# Altium schematic sheet GSM_Link_12_Power.SchDoc
size A
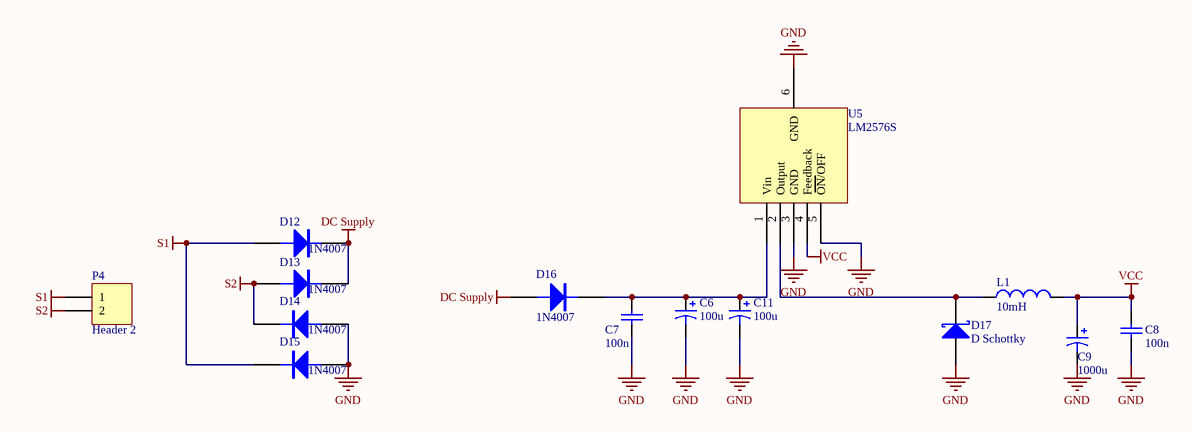
[diagram p0: GSM_Link_12_Power.SchDoc]

## Parts
C6  100u  [RB.2/.4_p]
C7  100n  [0805_smd]
C8  100n  [0805_smd]
C9  1000u  [RB.2/.4_p]
C11  100u  [RB.1/.2_P]
D12  1N4007  [7227_SMD]
D13  1N4007  [7227_SMD]
D14  1N4007  [7227_SMD]
D15  1N4007  [7227_SMD]
D16  1N4007  [7227_SMD]
D17  D Schottky  [7227_SMD]
L1  10mH  [RB.2/.4]
P4  Header 2  [PCON_2]
U5  LM2576S  [D2PAK_SMD]

## Nets
DC Supply: D12.K D13.K D16.A
GND: C6.2 C7.1 C8.1 C9.2 C11.2 D14.A D15.A D17.A U5.3(GND) U5.5(ON/OFF) U5.6(GND)
S1: D12.A D15.K P4.1
S2: D13.A D14.K P4.2
VCC: C8.2 C9.1 L1.2 U5.4(Feedback)
NetC6_1: C6.1 C7.2 C11.1 D16.K U5.1(Vin)
NetD17_K: D17.K L1.1 U5.2(Output)

## Library data of the parts
C6 C9 C11 = Cap Pol1: Polarized Capacitor (Radial); Value: 100nF; Published: 8-Jun-2000; LatestRevisionDate: 17-Jul-2002; LatestRevisionNote: Re-released for DXP Platform.; PackageReference: RB7.6-15; Publisher: Altium Limited
C7 C8 = Cap: Capacitor; Value: 100u; Published: 8-Jun-2000; LatestRevisionDate: 17-Jul-2002; LatestRevisionNote: Re-released for DXP Platform.; PackageReference: RAD-0.3; Publisher: Altium Limited
D12-D16 = DIODE
D17 = D Schottky: Schottky Diode; Published: 8-Jun-2000; LatestRevisionDate: 17-Jul-2002; LatestRevisionNote: Re-released for DXP Platform.; PackageReference: SMB; Publisher: Altium Limited; Code_JEDEC: DO-214-AA
L1 = Inductor: Code_IEC: 1005; Published: 8-Jun-2000; LatestRevisionDate: 17-Jul-2002; LatestRevisionNote: Re-released for DXP Platform.; PackageReference: 0402-A; Publisher: Altium Limited; Code_JEITA: 0402; Value: 10mH
P4 = Header 2: Header, 2-Pin; LatestRevisionDate: 17-Jul-2002; LatestRevisionNote: Re-released for DXP Platform.; Publisher: Altium Limited